# EAGLE design Dual Power Supply Design (EAGLE 9.6.2)
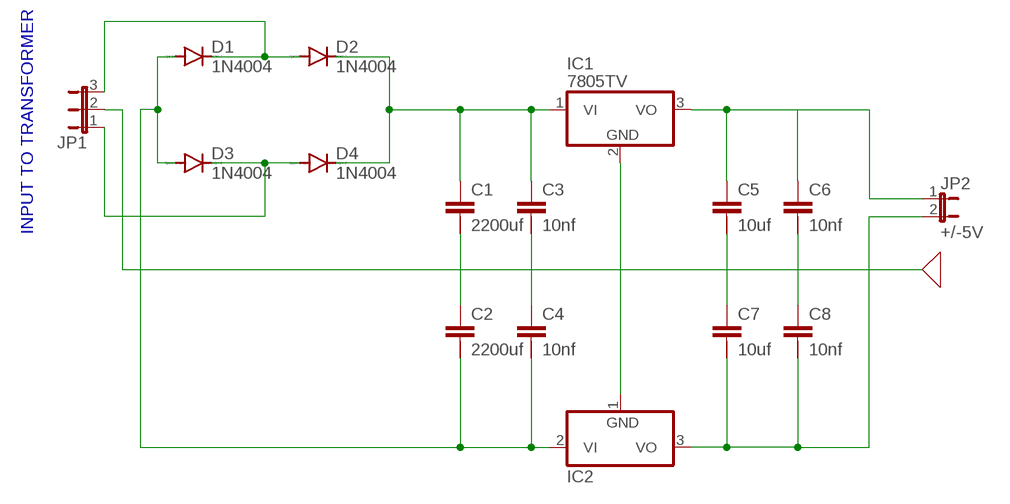
[diagram p0: schematic, sheet 1]

## Parts
C1  2200uf  C-2.5-5/2  [C2.5/5-2]
C2  2200uf  C-2.5-5/2  [C2.5/5-2]
C3  10nf  C-2.5-5/2  [C2.5/5-2]
C4  10nf  C-2.5-5/2  [C2.5/5-2]
C5  10uf  C-2.5-5/2  [C2.5/5-2]
C6  10nf  C-2.5-5/2  [C2.5/5-2]
C7  10uf  C-2.5-5/2  [C2.5/5-2]
C8  10nf  C-2.5-5/2  [C2.5/5-2]
D1  1N4004  [DO41-10]
D2  1N4004  [DO41-10]
D3  1N4004  [DO41-10]
D4  1N4004  [DO41-10]
IC1  7805TV  [TO220V]
IC2  7905T  [TO220H]
JP1  JP2W  [JP2W]
JP2  +/-5V  JP1E  [JP1]

## Nets
N$1: D1.C D2.A JP1.3
N$2: C1.1 C3.1 D2.C D4.C IC1.1(VI)
N$3: D3.C D4.A JP1.1
N$4: C2.2 C4.2 D1.A D3.A IC2.2(VI)
N$7: C1.2 C2.1
N$8: C3.2 C4.1
N$10: C5.1 IC1.3(VO) JP2.1
N$11: IC1.2(GND) IC2.1(GND)
N$12: JP1.2
N$13: C6.1
N$14: C5.2 C7.1
N$15: C7.2 C8.2 IC2.3(VO) JP2.2
N$16: C6.2 C8.1
Unconnected: C1.3 C2.3 C3.3 C4.3 C5.3 C6.3 C7.3 C8.3

## Notes on the sheet
- INPUT TO TRANSFORMER

## Library data of the parts
C1-C8 = capacitor-wima:C-: CAPACITOR for alternative placement naming: default grid - extended grid/package width
D1-D4 = diode:1N4004: DIODE general purpose rectifier, 1 A
IC1 = linear:78*: Positive VOLTAGE REGULATOR Source: http://cache.national.com/ds/LM/LM78L05.pdf http://www.fairchildsemi.com/ds/LM/LM7805.pdf
IC2 = linear:79*: Negative VOLTAGE REGULATOR
JP1 = jumper:JP2W: JUMPER
JP2 = jumper:JP1E: JUMPER

## Board
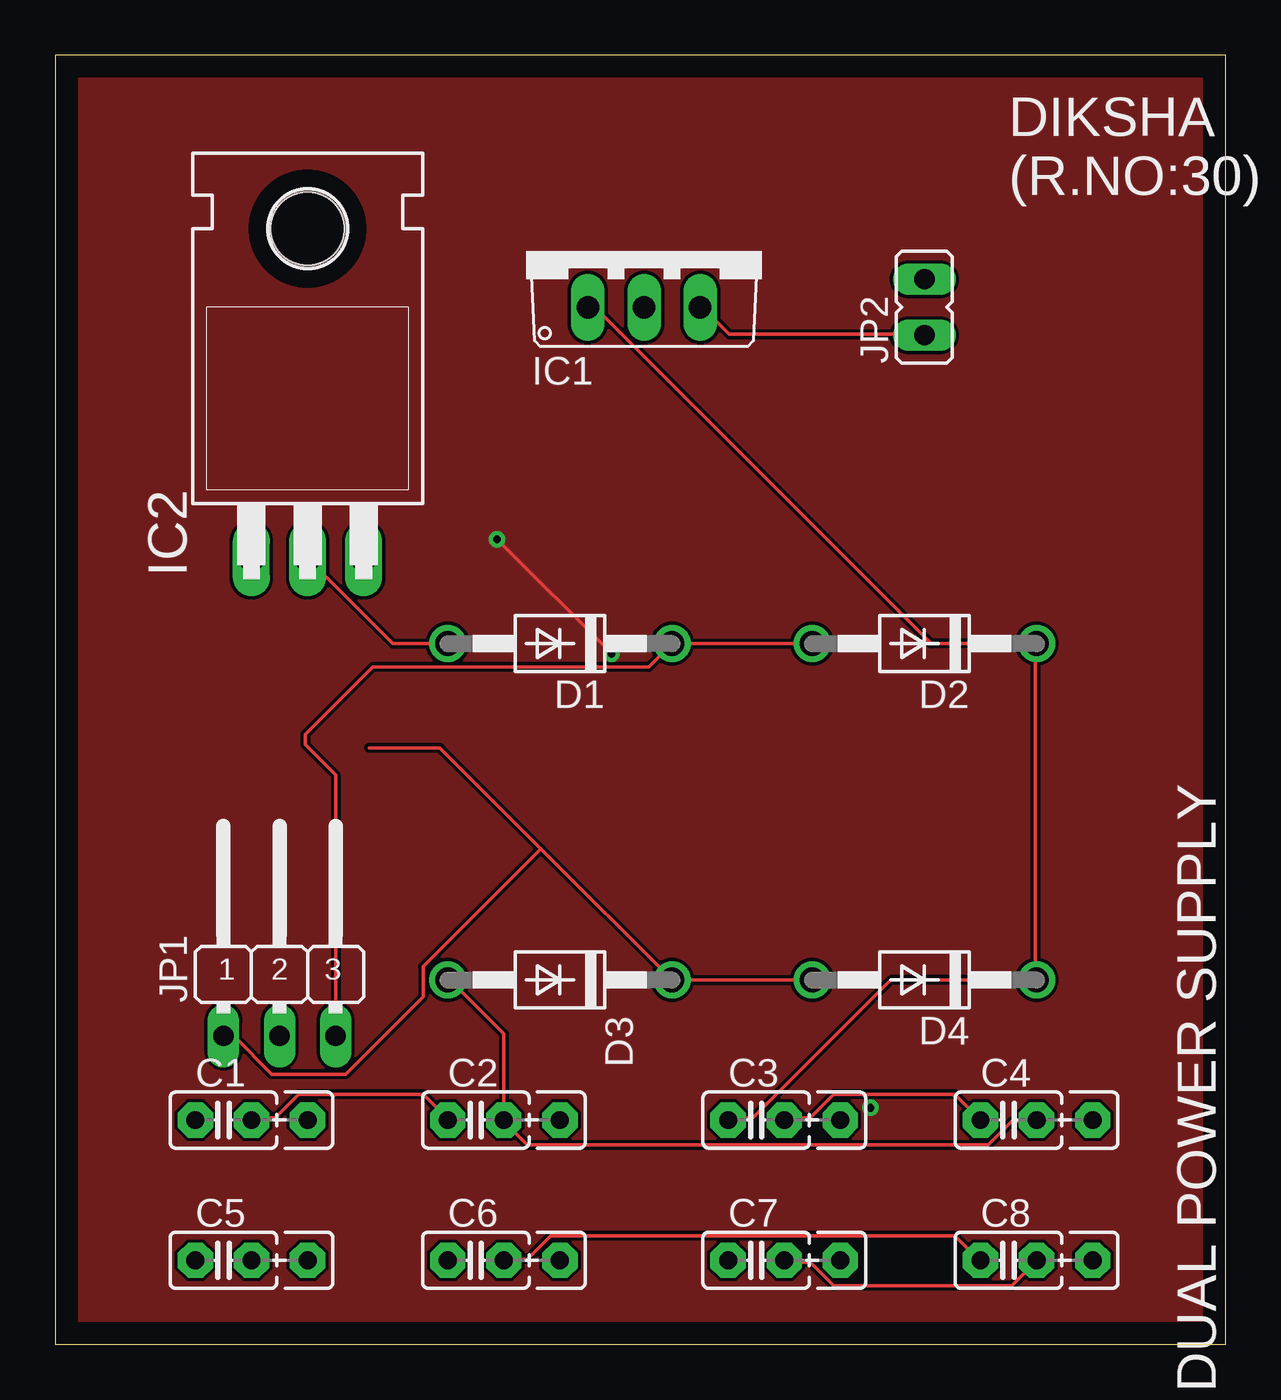
[diagram p1: board, top side]
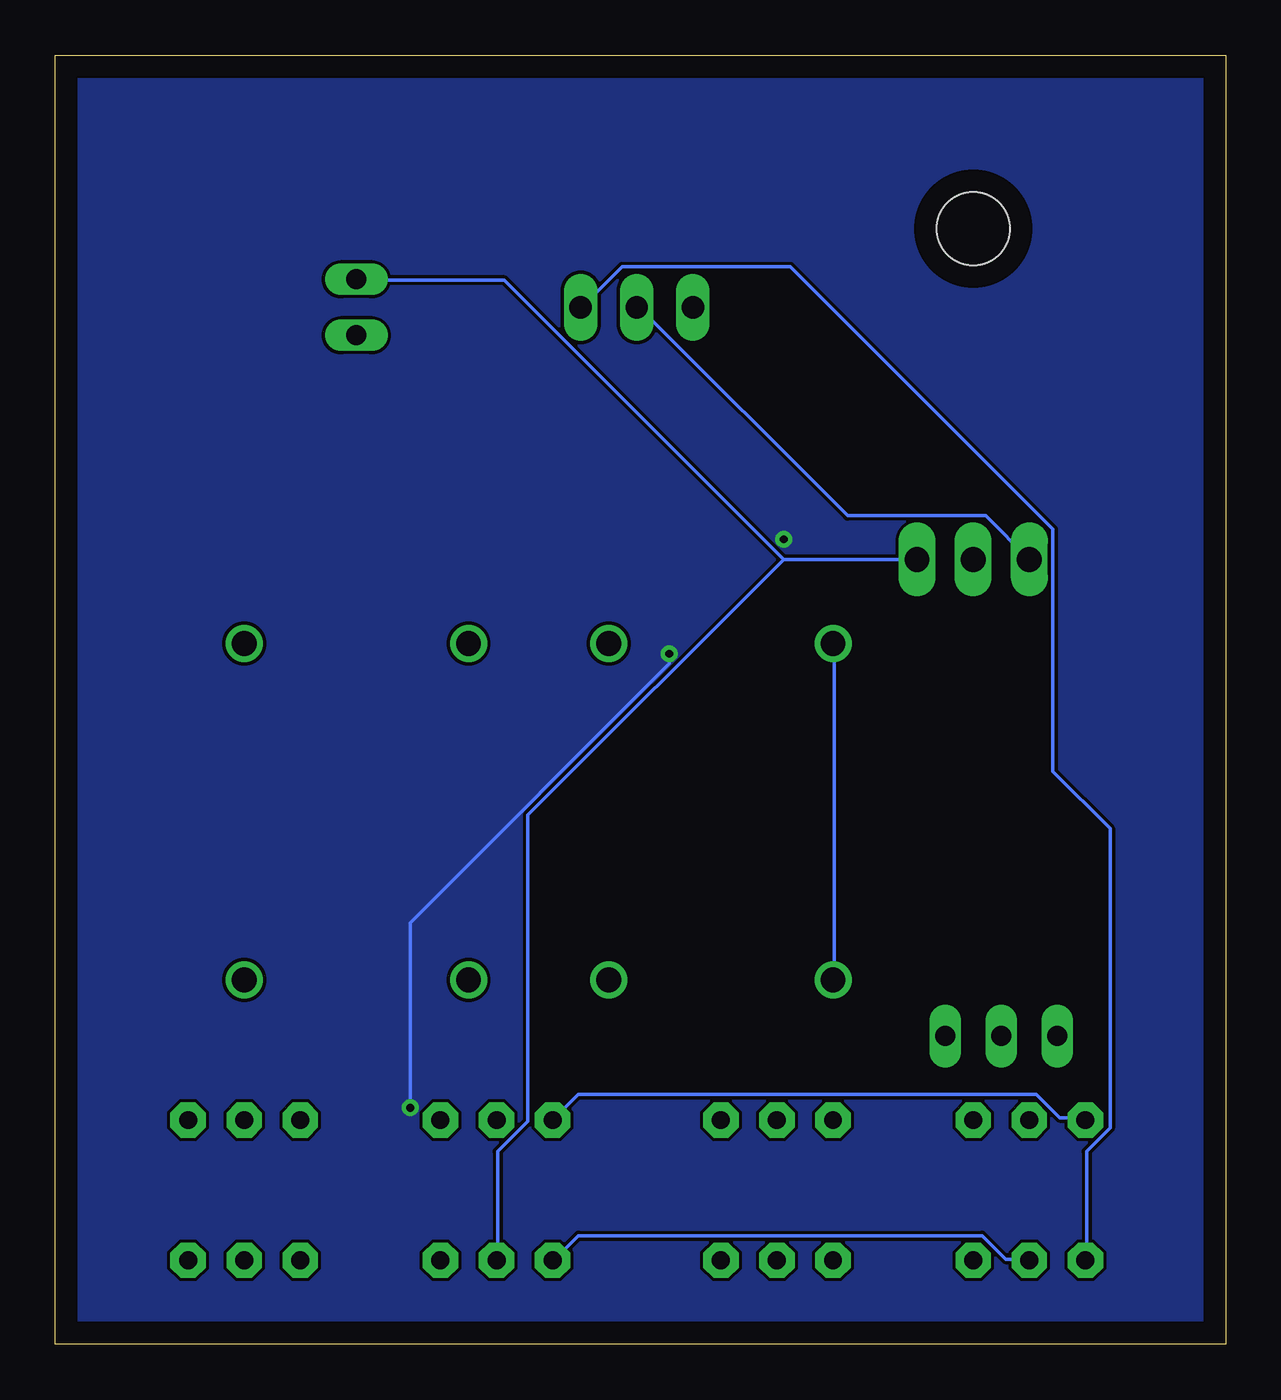
[diagram p2: board, bottom side, seen from below]

Size 53.01 x 58.41 mm. Coordinates in mm from the lower left corner, seen from the top.
Outline: 0,0 53.01,0 53.01,58.41 0,58.41 0,0
Copper layers (1*16): Top 0.035mm / dielectric 1.5mm / Bottom 0.035mm
Design rules "default": minimum track width 6mil, minimum drill 0.35mm, track to track 6mil, track to pad 6mil, pad to pad 6mil, via to via 6mil, smd to smd 6mil, copper to edge 40mil, drill to drill 6mil, minimum pad ring 10mil, minimum via ring 8mil, stop-mask expansion 4mil, vias tented up to drill 0mil, thermal gap 10mil

### Footprints (pad centres in the part's own frame; a part is rotated, then mirrored left to right if it is on the bottom)
C2.5/5-2 = drill 0.813 pad 1.6 octagon: 1 -1.27,0; 2 1.27,0; 3 3.81,0
DO41-10 = drill 1.118: A 5.08,0; C -5.08,0
TO220V = drill 1.016 long: 1 -2.54,-2.54; 2 0,-2.54; 3 2.54,-2.54
TO220H = drill 1.118 long: 1 -2.54,-10.16; 2 0,-10.16; 3 2.54,-10.16 | hole 3.302: 0,4.826
JP2W = drill 0.914 long: 1 -2.54,-1.27; 2 0,-1.27; 3 2.54,-1.27
JP1 = drill 0.914 long: 1 0,-1.27; 2 0,1.27

### Placement (x,y rotation side)
C1  7.62,10.16 0 top
C2  19.05,10.16 0 top
C3  31.75,10.16 0 top
C4  43.18,10.16 0 top
C5  7.62,3.81 0 top
C6  19.05,3.81 0 top
C7  31.75,3.81 0 top
C8  43.18,3.81 0 top
D1  22.86,31.75 180 top
D2  39.37,31.75 180 top
D3  22.86,16.51 180 top
D4  39.37,16.51 180 top
IC1  26.67,49.53 0 top
IC2  11.43,45.72 0 top
JP1  10.16,15.24 0 top
JP2  39.37,46.99 0 top

### Tracks (layer width: path | path; a pad name or v marks a point on that pad's centre or on a via)
C1  (via drill 0.35)
  Top 0.152: v25.2,31.29 v20.02,36.47
  Bottom 0.152: v25.2,31.29 25.2,30.84 36.93,19.1 v36.93,10.72
  pour Bottom: -2.54,60.96 -2.54,-3.81 55.88,-3.81 55.88,-1.27 55.88,60.96
  pour Top: -3.81,62.23 -3.81,-6.35 57.15,-6.35 57.15,62.23
N$1
  Top 0.152: D2.A D1.C 26.87,30.68 14.38,30.68 11.33,27.63 11.33,27.18 12.7,25.81 JP1.3
N$2
  Top 0.152: IC1.1 24.44,46.99 39.68,31.75 44.4,31.75 | 44.4,31.75 44.4,16.51 | 44.4,31.75 D2.C | 44.4,16.51 37.85,16.51 31.6,10.26 30.53,10.26 C3.1 | 44.4,16.51 D4.C
  Bottom 0.152: C3.1 29.31,11.33 8.59,11.33 7.52,10.26 6.45,10.26 C1.1
N$3
  Top 0.152: 14.22,27.03 17.42,27.03 22,22.45 | 22,22.45 D3.C D4.A | 22,22.45 16.66,17.12 16.66,15.75 13.16,12.24 9.8,12.24 8.13,13.92 7.67,13.92 JP1.1
N$4
  Top 0.152: D1.A 15.29,31.75 11.48,35.56 IC2.2 | D3.A 17.88,16.51 20.32,14.07 C2.2 20.32,10.11 21.39,9.04 42.27,9.04 43.33,10.11 44.4,10.11 C4.2
  Bottom 0.152: D1.A 17.73,31.75 17.73,16.51 D3.A
N$7
  Top 0.152: C1.2 8.89,10.26 9.96,10.26 11.02,11.33 16.66,11.33 17.73,10.26 C2.1
N$8
  Top 0.152: C4.1 40.74,11.33 35.26,11.33 34.19,10.26 33.12,10.26 C3.2
N$10
  Top 0.152: JP2.1 39.37,45.77 30.53,45.77 29.31,46.99 IC1.3
  Bottom 0.152: C5.1 6.3,3.86 6.3,8.74 5.23,9.8 5.23,23.37 7.82,25.96 7.82,36.93 19.71,48.82 27.33,48.82 29.16,46.99 IC1.3
N$11
  Bottom 0.152: IC2.1 10.87,37.54 17.12,37.54 26.57,46.99 IC1.2
N$14
  Bottom 0.152: C5.2 8.89,3.86 9.96,3.86 11.02,4.93 29.31,4.93 30.38,3.86 C7.1
N$15
  Top 0.152: C7.2 33.12,3.71 34.19,3.71 35.26,2.64 43.33,2.64 44.4,3.71 C8.2
  Bottom 0.152: 20.02,35.56 32.66,48.21 39.37,48.21 JP2.2 | IC2.3 20.02,35.56 | 20.02,35.56 31.6,23.98 31.6,10.11 32.97,8.74 32.97,3.86 C7.2
N$16
  Top 0.152: C6.2 20.32,3.86 21.39,3.86 22.45,4.93 40.74,4.93 41.81,3.86 C8.1

### Text on the board
tPlace: DIKSHA / (R.NO:30) | DUAL POWER SUPPLY